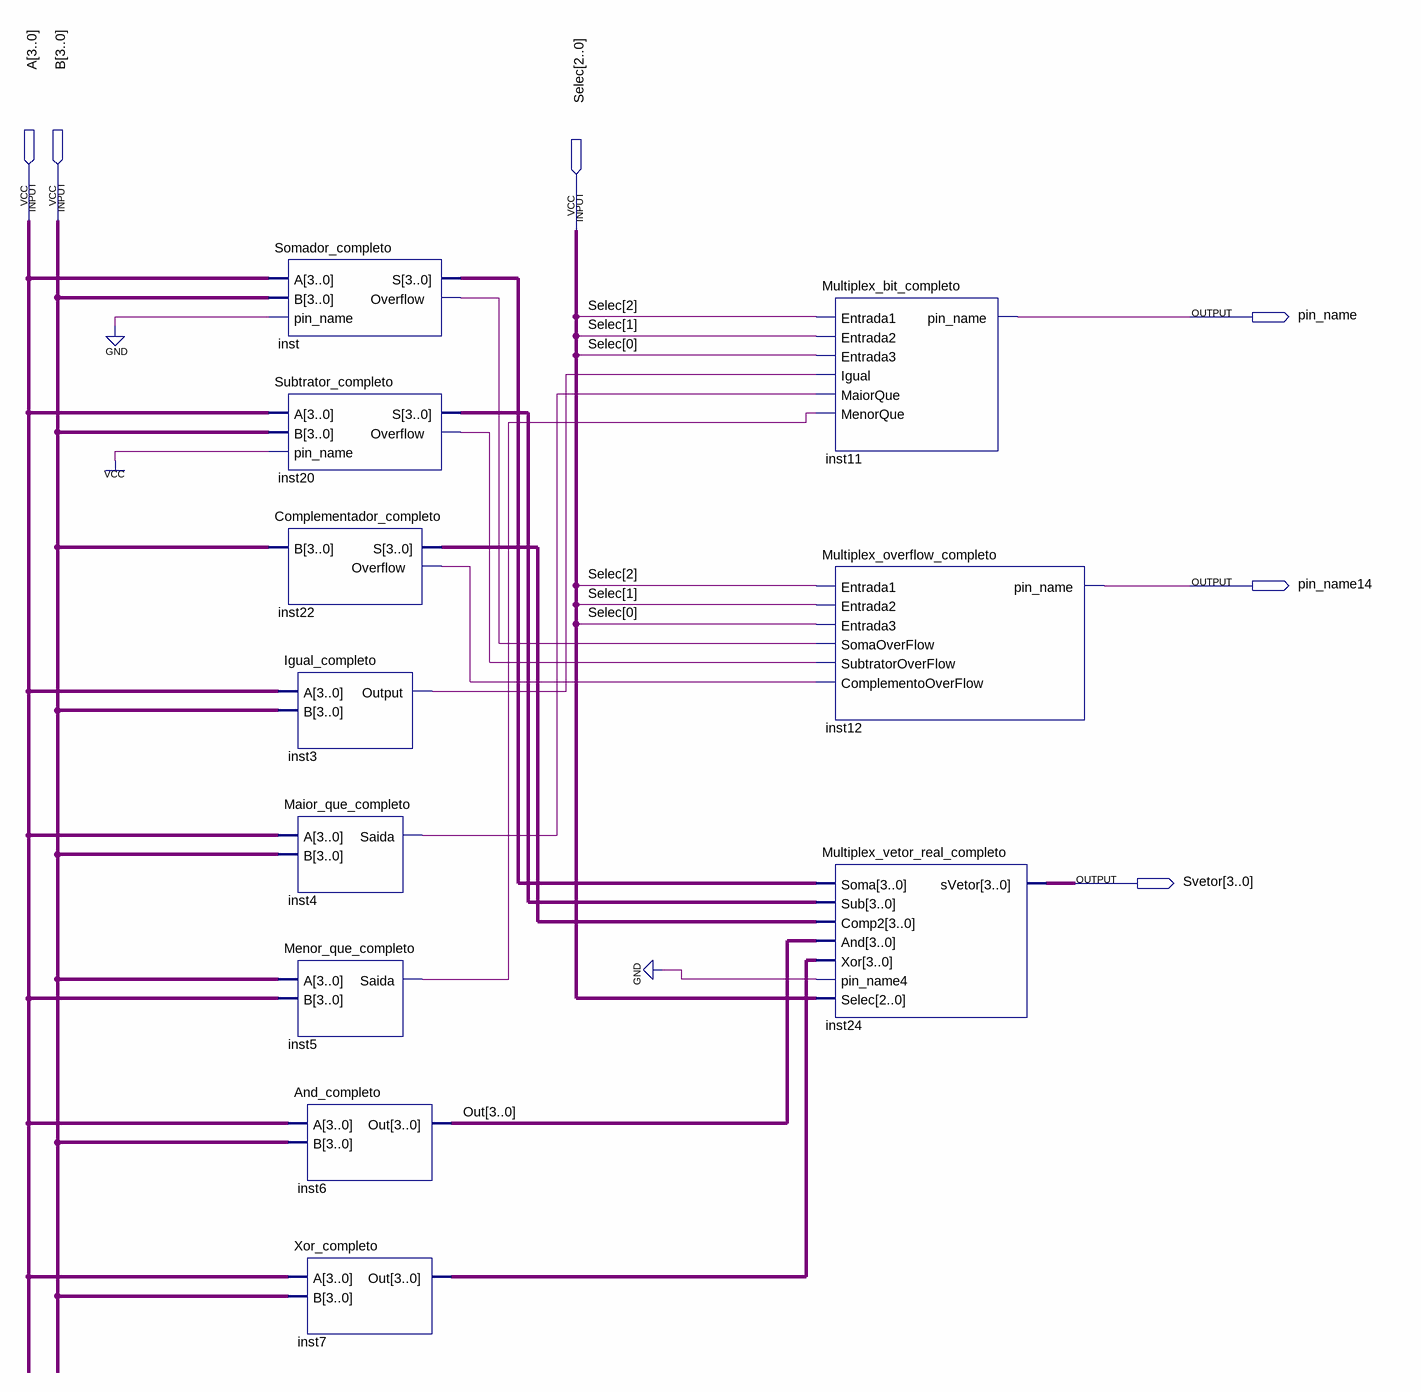
[diagram p0: schematic sheet]
// Quartus schematic ula_completo.bdf as structural Verilog: 11 symbols, 6 pins
module ula_completo (
  input  [3:0] A,
  input  [3:0] B,
  input  [2:0] Selec,
  output pin_name,
  output pin_name14,
  output [3:0] Svetor
);

  wire inst3_output, inst4_saida, inst5_saida, inst20_overflow, inst22_overflow, inst_overflow;
  wire [3:0] inst7_out, inst20_s, inst22_s, inst_s, Out;

  Somador_completo inst (.A(A), .B(B), .pin_name(1'b0), .S(inst_s), .Overflow(inst_overflow));
  Subtrator_completo inst20 (.A(A), .B(B), .pin_name(1'b1), .S(inst20_s), .Overflow(inst20_overflow));
  Complementador_completo inst22 (.B(B), .S(inst22_s), .Overflow(inst22_overflow));
  Igual_completo inst3 (.A(A), .B(B), .Output(inst3_output));
  Maior_que_completo inst4 (.A(A), .B(B), .Saida(inst4_saida));
  Menor_que_completo inst5 (.A(B), .B(A), .Saida(inst5_saida));
  And_completo inst6 (.A(A), .B(B), .Out(Out));
  Xor_completo inst7 (.A(A), .B(B), .Out(inst7_out));
  Multiplex_bit_completo inst11 (
    .Entrada1(Selec[2]), .Entrada2(Selec[1]), .Entrada3(Selec[0]), .Igual(inst3_output),
    .MaiorQue(inst4_saida), .MenorQue(inst5_saida), .pin_name(pin_name));
  Multiplex_overflow_completo inst12 (
    .Entrada1(Selec[2]), .Entrada2(Selec[1]), .Entrada3(Selec[0]), .SomaOverFlow(inst_overflow),
    .SubtratorOverFlow(inst20_overflow), .ComplementoOverFlow(inst22_overflow), .pin_name(pin_name14));
  Multiplex_vetor_real_completo inst24 (
    .Soma(inst_s), .Sub(inst20_s), .Comp2(inst22_s), .And(Out), .Xor(inst7_out), .pin_name4(1'b0),
    .Selec(Selec), .sVetor(Svetor));
endmodule
